# EAGLE schematic v3_bluetooth-20x20_chip-ant_dc-dc (EAGLE 9.0.0)
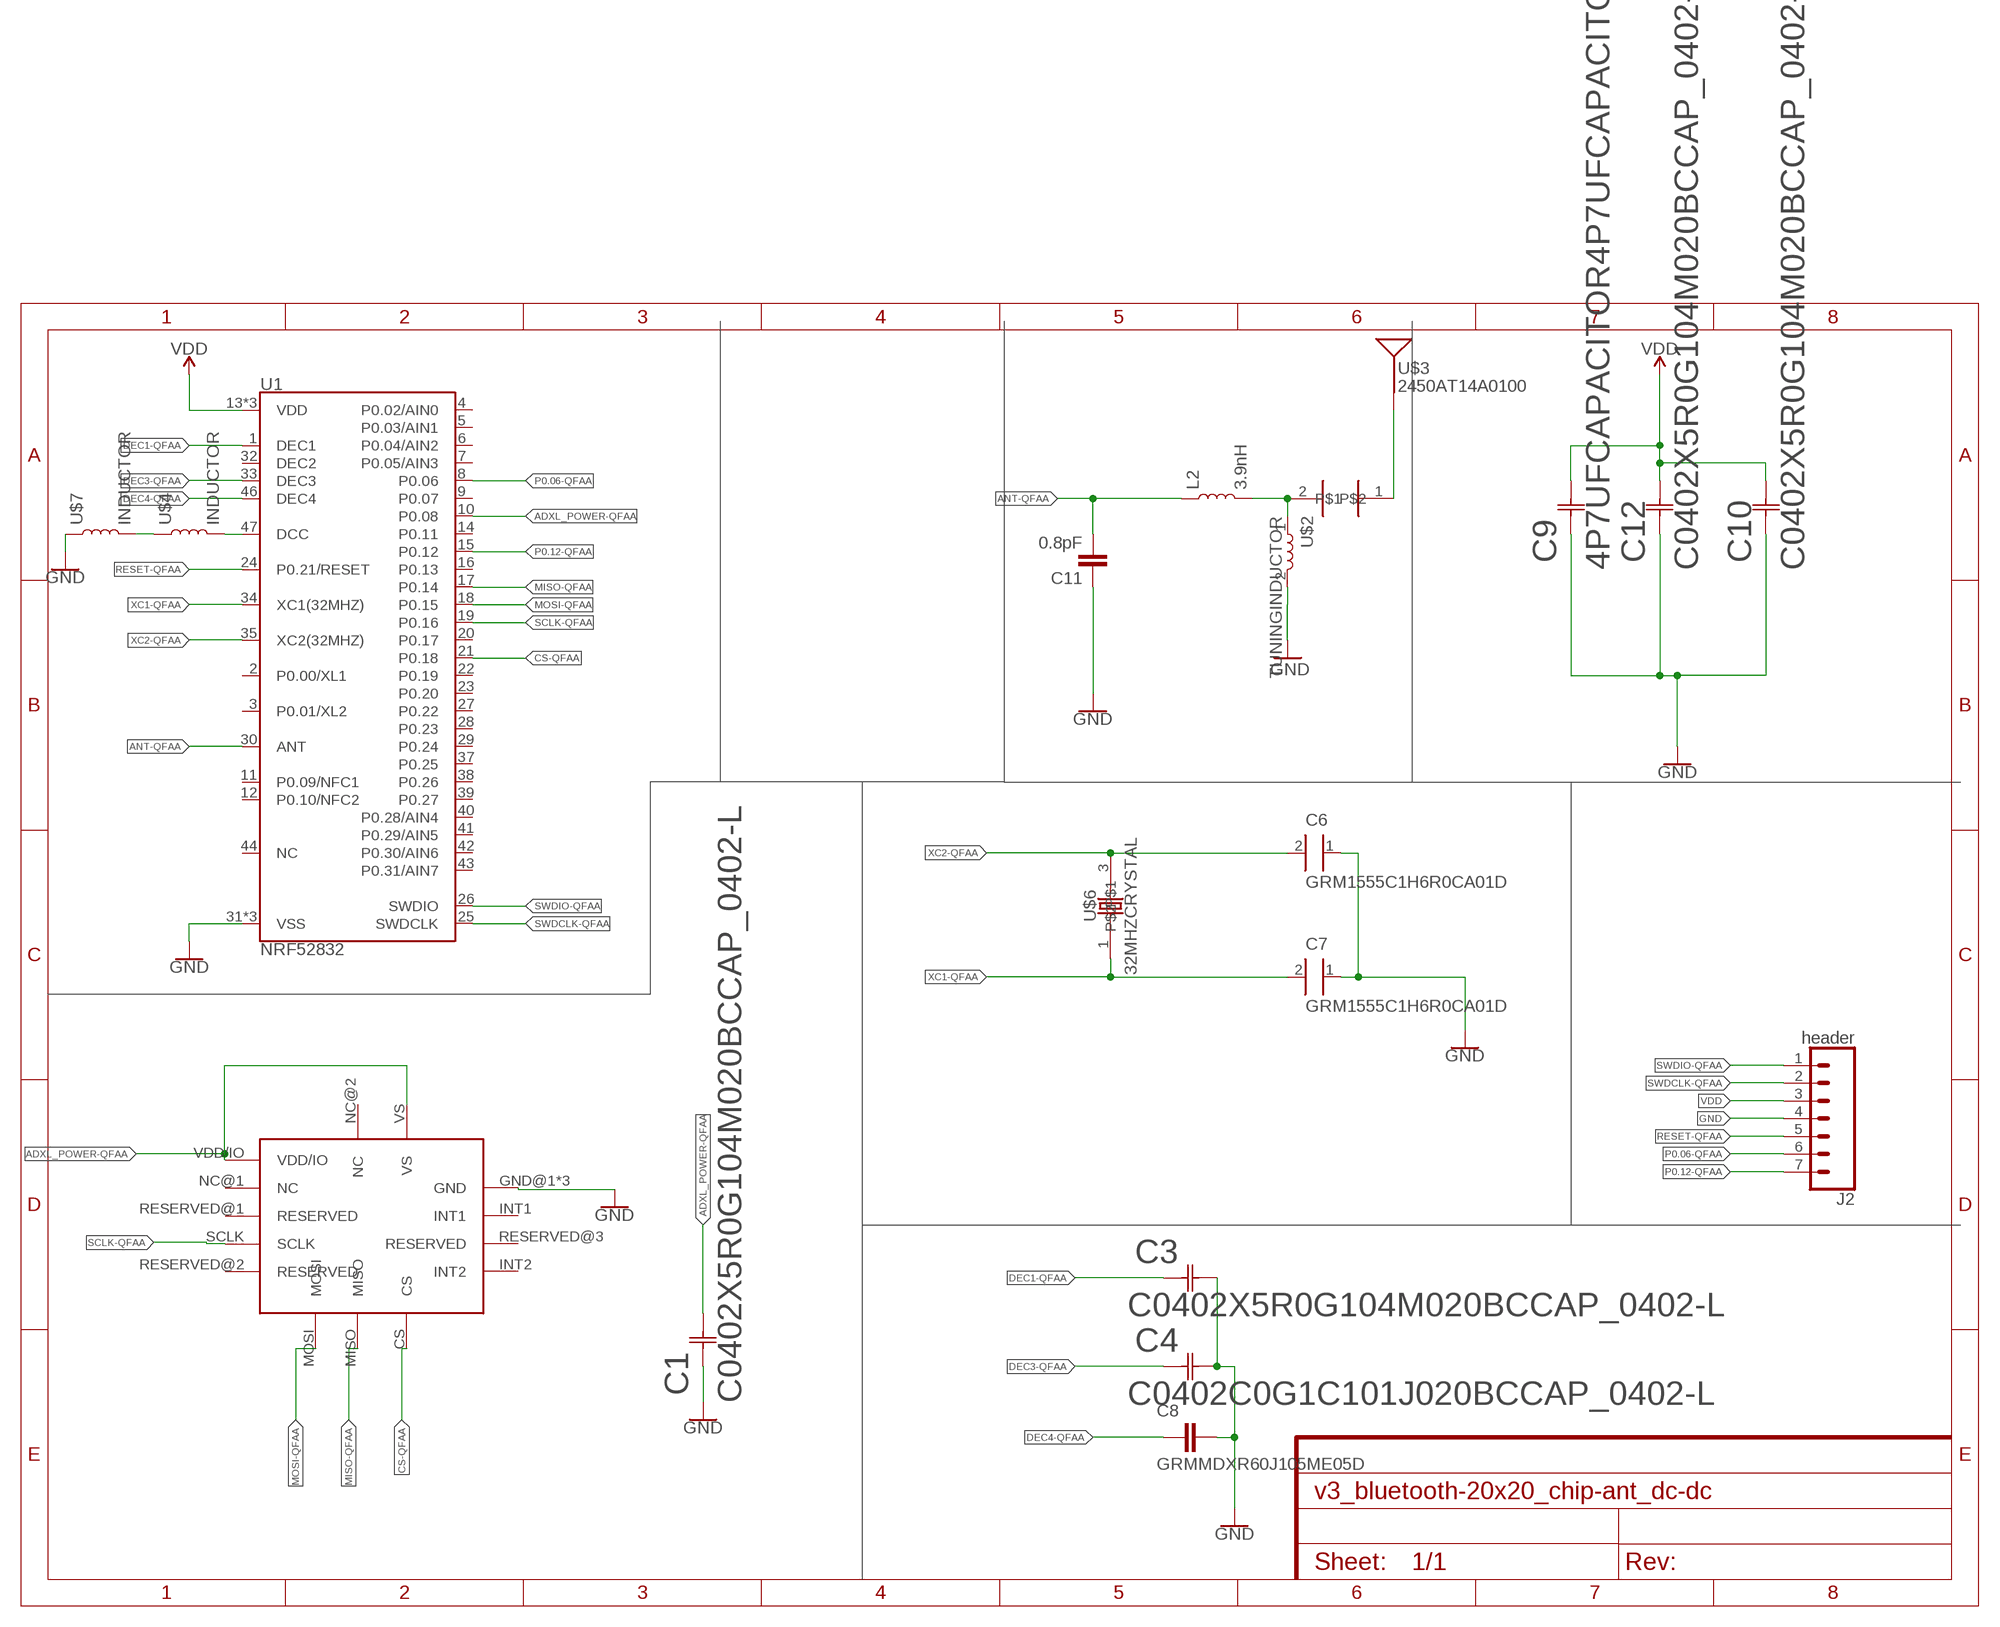
[diagram p0: schematic, sheet 1]

## Parts
C1  C0402X5R0G104M020BCCAP_0402-L  [CAP_0402-L]
C3  C0402X5R0G104M020BCCAP_0402-L  [CAP_0402-L]
C4  C0402C0G1C101J020BCCAP_0402-L  [CAP_0402-L]
C6  GRM1555C1H6R0CA01D  [CAPC1005X55N]
C7  GRM1555C1H6R0CA01D  [CAPC1005X55N]
C8  GRMMDXR60J105ME05D  [CAPC0502X28N]
C9  4P7UFCAPACITOR4P7UFCAPACITOR  [4P7UFCAPACITOR]
C10  C0402X5R0G104M020BCCAP_0402-L  [CAP_0402-L]
C11  0.8pF  0.8PF-0402-50V-0.1PF  [0402]
C12  C0402X5R0G104M020BCCAP_0402-L  [CAP_0402-L]
J2  header  CONN_07  [1X07]
L2  3.9nH  INDUCTOR-0402-3.9NH  [0402]
U1  NRF52832  [QFN48-6X6MM]
U$1  ADXL362  [TFLGA-16/3.3MMX3.1MM]
U$2  TUNINGINDUCTOR  [0402]
U$3  2450AT14A0100  [2450AT14A0100]
U$4  INDUCTOR  [0402]
U$5  0402-1005  [0402-1005]
U$6  32MHZCRYSTAL  [32MHZCRYSTAL]
U$7  INDUCTOR  [0402]

## Nets
ADXL_POWER-QFAA: C1.2 U1.10(P0.08) U$1.VDD/IO U$1.VS
ANT-QFAA: C11.2 L2.1 U1.30(ANT)
CS-QFAA: U1.21(P0.18) U$1.CS
DEC1-QFAA: C3.1 U1.1(DEC1)
DEC3-QFAA: C4.1 U1.33(DEC3)
DEC4-QFAA: C8.1 U1.46(DEC4)
GND: C1.1 C3.2 C4.2 C6.1 C7.1 C8.2 C9.1 C10.1 C11.1 C12.1 J2.4 U1.31(VSS) U1.45(VSS) U1.EP(VSS) U$1.GND@1(GND) U$1.GND@2(GND) U$1.GND@3(GND) U$2.2 U$7.1
MISO-QFAA: U1.17(P0.14) U$1.MISO
MOSI-QFAA: U1.18(P0.15) U$1.MOSI
N$1: L2.2 U$2.1 U$5.2
N$2: U$3.FEED(SIGNAL) U$5.1
N$4: U1.47(DCC) U$4.2
N$5: U$4.1 U$7.2
P0.06-QFAA: J2.6 U1.8(P0.06)
P0.12-QFAA: J2.7 U1.15(P0.12)
RESET-QFAA: J2.5 U1.24(P0.21/RESET)
SCLK-QFAA: U1.19(P0.16) U$1.SCLK
SWDCLK-QFAA: J2.2 U1.25(SWDCLK)
SWDIO-QFAA: J2.1 U1.26(SWDIO)
VDD: C9.2 C10.2 C12.2 J2.3 U1.13(VDD) U1.36(VDD) U1.48(VDD)
XC1-QFAA: C7.2 U1.34(XC1(32MHZ)) U$6.1
XC2-QFAA: C6.2 U1.35(XC2(32MHZ)) U$6.3
Unconnected: U1.2(P0.00/XL1) U1.3(P0.01/XL2) U1.4(P0.02/AIN0) U1.5(P0.03/AIN1) U1.6(P0.04/AIN2) U1.7(P0.05/AIN3) U1.9(P0.07) U1.11(P0.09/NFC1) U1.12(P0.10/NFC2) U1.14(P0.11) U1.16(P0.13) U1.20(P0.17) U1.22(P0.19) U1.23(P0.20) U1.27(P0.22) U1.28(P0.23) U1.29(P0.24) U1.32(DEC2) U1.37(P0.25) U1.38(P0.26) U1.39(P0.27) U1.40(P0.28/AIN4) U1.41(P0.29/AIN5) U1.42(P0.30/AIN6) U1.43(P0.31/AIN7) U1.44(NC) U$1.INT1 U$1.INT2 U$1.NC@1(NC) U$1.NC@2(NC) U$1.RESERVED@1(RESERVED) U$1.RESERVED@2(RESERVED) U$1.RESERVED@3(RESERVED)

## Library data of the parts
C1 C3 C10 C12 = 0p1_uF_capacitor:C0402X5R0G104M020BC; MANUFACTURER_PART_NUMBER: C0402C0G1C101J020BC; VENDOR: TDK
C4 = 100_pF_capacitor:C0402C0G1C101J020BC; MANUFACTURER_PART_NUMBER: C0402C0G1C101J020BC; VENDOR: TDK
C6 C7 = 6pf_capacitor_new-bigger:GRM1555C1H6R0CA01D: Cap Ceramic 6pF 50V C0G 0.25pF Pad SMD 0402 125C T/R; DESCRIPTION: 0402 6 pF 50 V ±0.25 pF Tolerance C0G SMT Multilayer Ceramic Capacitor; DIGI-KEY_PART_NUMBER: 490-8222-1-ND; DIGI-KEY_PURCHASE_URL: https://www.digikey.com/product-detail/en/murata-electronics-north-america/GRM1555C1H6R0CA01D/490-8222-1-ND/4380516?WT.z_cid=ref_snapeda&utm_source=snapeda&utm_medium=aggregator&utm_campaign=buynow; MF: Murata; MP: GRM1555C1H6R0CA01D; PACKAGE: 0402 Murata
C8 = 1UFCAPACITOR:GRMMDXR60J105ME05D: Cap, Mlcc, X5r, 1uf, 6.3v, 015008; DESCRIPTION: Cap, Mlcc, X5r, 1uf, 6.3v, 015008; DIGI-KEY_PART_NUMBER: 490-13424-1-ND; DIGI-KEY_PURCHASE_URL: https://www.digikey.com/product-detail/en/murata-electronics-north-america/GRMMDXR60J105ME05D/490-13424-1-ND/6023636?WT.z_cid=ref_snapeda&utm_source=snapeda&utm_medium=aggregator&utm_campaign=buynow; MF: Murata; MP: GRMMDXR60J105ME05D; PACKAGE: 015008 Murata
C9 = 4p7_uF_capacitor:4P7UFCAPACITOR; MANUFACTURER_PART_NUMBER: C0816X5R0J475M050AC; VENDOR: TDK
C11 = nrf52832-breakout-temp:0.8PF: 0.8pF ceramic capacitors A capacitor is a passive two-terminal electrical component used to store electrical energy temporarily in an electric field.; PROD_ID: CAP-13456
J2 = SparkFun-Connectors:CONN_07: Multi connection point. Often used as Generic Header-pin footprint for 0.1 inch spaced/style header connections On any of the 0.1 inch spaced packages, you can populate with these: Break Away Headers - Straight <https://www.sparkfun.com/products/116> (PRT-00116) Break Away Male Headers - Right Angle <https://www.sparkfun.com/products/553> (PRT-00553) Female Headers <https://www.sparkfun.com/products/115> (PRT-00115) Break Away Headers - Machine Pin <https://www.sparkfun.com/products/117> (PRT-00117) Break Away Female Headers - Swiss Machine Pin <https://www.sparkfun.com/products/743> (PRT-00743) For SCREWTERMINALS and SPRING TERMINALS visit here: Screw Terimnals on SparkFun.com <https://www.sparkfun.com/search/results?term=Screw+Terminals> (5mm/3.5mm/2.54mm spacing) This device is also useful as a general connection point to wire up your design to another part of your project. Our various solder wires solder well into these plated through hole pads. Hook-Up Wire - Assortment (Stranded, 22 AWG) <https://www.sparkfun.com/products/11375> (PRT-11375) Hook-Up Wire - Assortment (Solid Core, 22 AWG) <https://www.sparkfun.com/products/11367> (PRT-11367) View the entire wire category on our website here <https://www.sparkfun.com/categories/141> Special notes: Molex polarized connector foot print use with SKU : PRT-08231 with associated crimp pins and housings. 1MM SMD Version SKU: PRT-10208 NOTES ON THE VARIANTS LOCK and LOCK_LONGPADS... This footprint was designed to help hold the alignment of a through-hole component (i.e. 6-pin header) while soldering it into place. You may notice that each hole has been shifted either up or down by 0.005 of an inch from it's more standard position (which is a perfectly straight line). This slight alteration caused the pins (the squares in the middle) to touch the edges of the holes. Because they are alternating, it causes a "brace" to hold the component in place. 0.005 has proven to be the perfect amount of "off-center" position when using our standard breakaway headers. Although looks a little odd when you look at the bare footprint, once you have a header in there, the alteration is very hard to notice. Also,if you push a header all the way into place, it is covered up entirely on the bottom side.
L2 = nrf52832-breakout-temp:INDUCTOR: Inductors Resist changes in electrical current. Basically a coil of wire. SparkFun Products: SparkFun Load Cell Amplifier - HX711 <https://www.sparkfun.com/products/13879> IOIO-OTG - V2.2 <https://www.sparkfun.com/products/13613>; PROD_ID: NDUC-13457
U1 = nrf52832-breakout-temp:NRF52832: Nordic nRF52832 Bluetooth Smart/ANT/2.4GHz RF SoC The nRF52832 SoC is a powerful, highly flexible ultra-low power multiprotocol SoC ideally suited for Bluetooth® Smart ANT and 2.4GHz ultra low-power wireless applications. The nRF52832 SoC is built around a 32-bit ARM® Cortex™-M4F CPU with 512kB + 64kB RAM. The embedded 2.4GHz transceiver supports Bluetooth Smart, ANT and proprietary 2.4 GHz protocol stack. It is on air compatible with the nRF51 Series, nRF24L and nRF24AP Series products from Nordic Semiconductor. Product Page <https://www.nordicsemi.com/eng/Products/Bluetooth-low-energy2/nRF52832>; PROD_ID: IC-13460
U$1 = ADXL362:ADXL362
U$2 = tuninginductor:TUNINGINDUCTOR
U$3 = antennanew:2450AT14A0100
U$4 U$7 = inductor:INDUCTOR
U$5 = 0402-1005:0402-1005
U$6 = 32_mhz_crystal:32MHZCRYSTAL